# Altium schematic sheet USB2Serial.SchDoc
size 190 x 127 mm; SheetNumber: 4; SheetTotal: 6
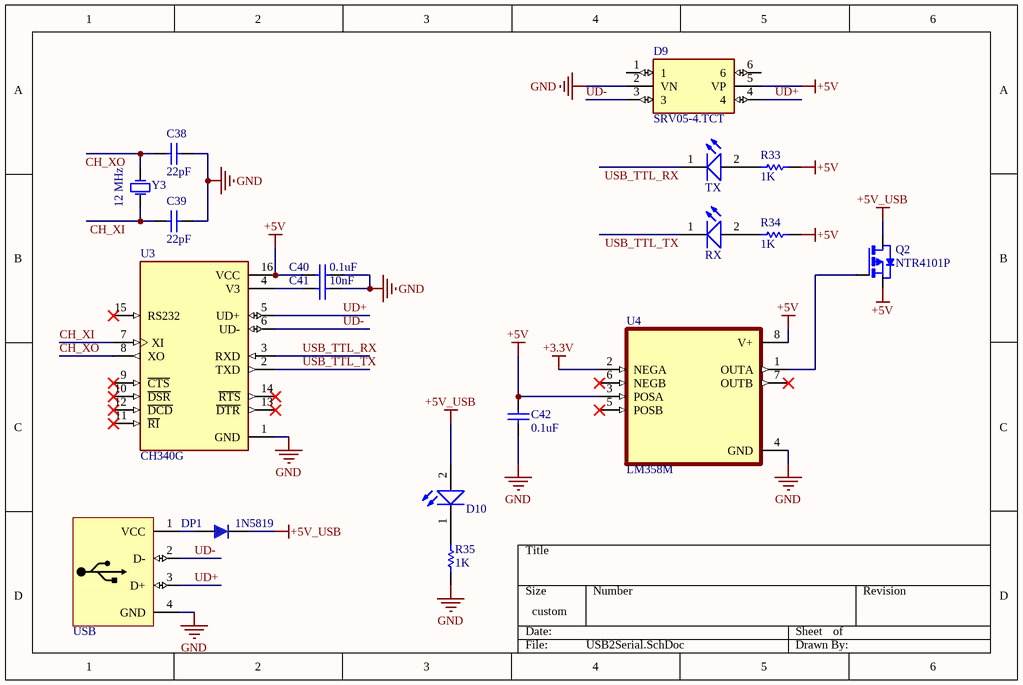
[diagram p0: USB2Serial.SchDoc]

## Parts
C38  22pF  [CAPC3413X12N]
C39  22pF  [CAPC3413X12N]
C40  0.1uF  [CAPC3413X12N]
C41  10nF  [CAPC3413X12N]
C42  0.1uF  [CAPC3413X12N]
D9  SRV05-4.TCT  [SOT95P280X145-6N]
D10  LED SMD PACKAGE  [LED_SMD_0805]  (value not drawn)
DP1  1N5819  [430X270D]
Q2  NTR4101P  [SOT23]
R33  1K  [RESC3413X04N]
R34  1K  [RESC3413X04N]
R35  1K  [RESC3413X04N]
RX  LED SMD PACKAGE  [LED_SMD_0805]  (value not drawn)
TX  LED SMD PACKAGE  [LED_SMD_0805]  (value not drawn)
U3  CH340G  [SOIC127P600X180-16N]
U4  LM358M  [SOIC127P599X175-8N]
USB  USB Connector  [USB2.5-2H4E]  (value not drawn)
Y3  12 MHz  [Crystal SMD]

## Nets
+3.3V: U4.2(NEGA)
+5V: C40.2 C42.2 D9.5(VP) Q2.2(S) R33.1 R34.1 U3.16(VCC) U4.3(POSA) U4.8(V+)
+5V_USB: D10.2(A) DP1.2 Q2.3(D)
GND: C38.1 C39.1 C40.1 C41.1 C42.1 D9.2(VN) R35.1 U3.1(GND) U4.4(GND) USB.4(GND)
CH_XI: C39.2 U3.7(XI) Y3.1(OSC1)
CH_XO: C38.2 U3.8(XO) Y3.2(OSC2)
UD+: D9.4 U3.5(UD+) USB.3(D+)
UD-: D9.3 U3.6(UD-) USB.2(D-)
USB_TTL_RX: TX.1(K) U3.3(RXD)
USB_TTL_TX: RX.1(K) U3.2(TXD)
NetC41_2: C41.2 U3.4(V3)
NetD10_1: D10.1(K) R35.2
NetDP1_1: DP1.1 USB.1(VCC)
NetQ2_1: Q2.1(G) U4.1(OUTA)
NetR33_2: R33.2 TX.2(A)
NetR34_2: R34.2 RX.2(A)

Not connected (* = marked no-connect by the designer): D9 1 6; U3 9(~{CTS})* 10(~{DSR})* 11(~{RI})* 12(~{DCD})* 13(~{DTR})* 14(~{RTS})* 15(RS232)*; U4 5(POSB)* 6(NEGB)* 7(OUTB)*

## Library data of the parts
C38-C42 = CAP SMD 0805: CAP 0805; Designer: Abbas Basereh; Desc.: CAP SMD 0805; Data: 16-12-2016
D9 = SRV05-4.TCT: 17.5V Clamp 12A (8/20Âµs) Ipp Tvs Diode Surface Mount SOT-23-6; MF: Semtech; Package: SOT-23 Semtech; Price: None; Value: *; SnapEDA_Link: https://www.snapeda.com/parts/SRV05-4.TCT/Semtech+Corporation/view-part/?ref=snap; MP: SRV05-4.TCT; Availability: In Stock; Check_prices: https://www.snapeda.com/parts/SRV05-4.TCT/Semtech+Corporation/view-part/?ref=eda
D10 RX TX = LED SMD PACKAGE: SMD Mono-color Chip LED Waterclear; Part Number: 150080BS75000; Peak Wavelength: 465 nm; Forward Voltage: 3.2 V; Published Date: Jan 2017; Publisher: Ali Hafizi
DP1 = 1N5819: Schottkey Rectifiers; Designer: Abbas Basereh; Data: 16-12-2016; Link: *; Part. No: *
Q2 = NTR4101P: P-Channel 20V 1.8A _Ta_ 420mW _Ta_ Surface Mount SOT-23-3 _TO-236_; MF: ON Semiconductor; SnapEDA_Link: https://www.snapeda.com/parts/NTR4101P/ON%20Semiconductor/view-part/4001076/?ref=snap; Price: None; MP: NTR4101P; Package: SOT-23 ON Semiconductor; Value: *; Availability: Unavailable
R33-R35 = RES 0805 0.125W: RES 0805; Designer: Abbas Basereh; Desc.: RES SMD 0805; Data: 16-12-2016
U3 = CH340G: USB Interface Integrated Circuit; MF: WCH; Value: *; SnapEDA_Link: https://www.snapeda.com/parts/Ch340G/WCH/view-part/?ref=snap; MP: Ch340G; Check_prices: https://www.snapeda.com/parts/Ch340G/WCH/view-part/?ref=eda; Availability: Not in stock; Price: None; Package: None
U4 = LM358M: 2-Channel, 1MHz, industry standard, 32V op amp 8-SOIC 0 to 70; MF: Texas Instruments; SnapEDA_Link: https://www.snapeda.com/parts/LM358M/Texas+Instruments/view-part/?ref=snap; Purchase-URL: https://pricing.snapeda.com/search/part/LM358M/?ref=eda; Value: *; MP: LM358M; Availability: In Stock; Check_prices: https://www.snapeda.com/parts/LM358M/Texas+Instruments/view-part/?ref=eda; Package: SOIC-8 Texas Instruments; Price: None
USB = USB B-Type: USB Connector-B Type; Adding Date: 10/26/2010
Y3 = XTAL: XTAL Crystal; Designer: ABBAS BASEREH; Design Date: 2017-1-3; ComponentLink1Description: Datasheet; ComponentLink2Description: Reference; Mounting Technology: Surface Mount\Through-Hole; Value: 12 MHz; Status: Unreleased